# Altium schematic sheet DP Mux.SchDoc
size A4; SheetNumber: 2; SheetTotal: 2
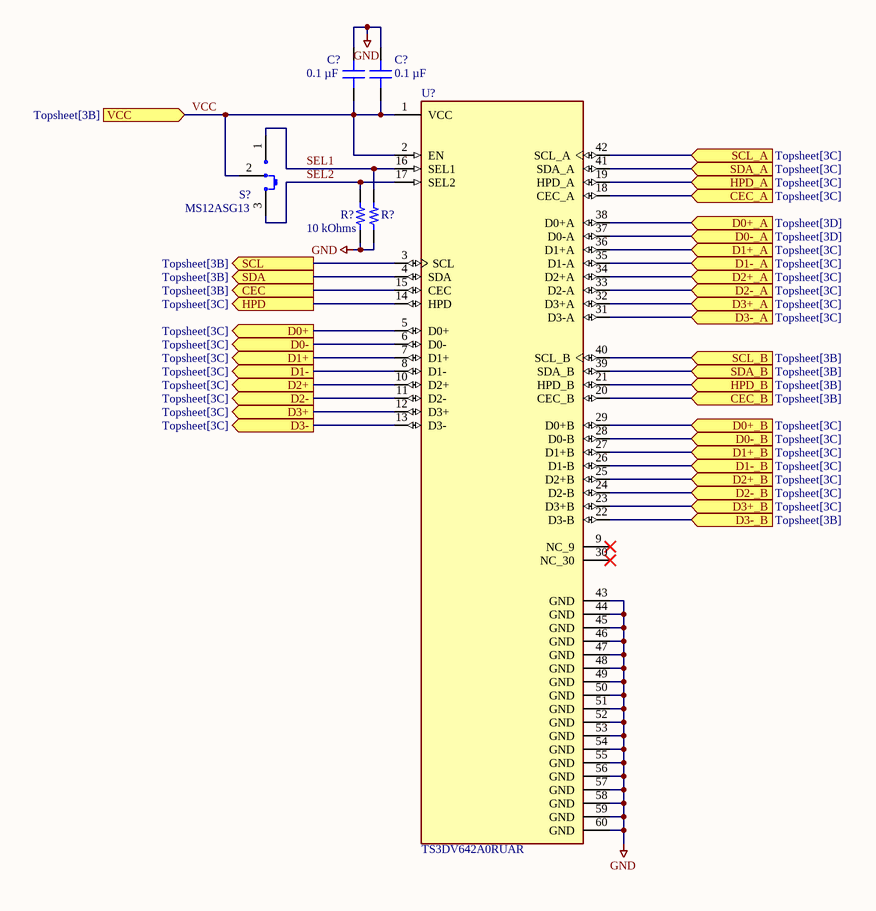
[diagram p0: DP Mux.SchDoc]

## Parts
(Parts that share a designator on the sheet are numbered #1, #2 ... from top to bottom, then left to right.)
C?#1  0.1 µF  [CAP 0402_1005]
C?#2  0.1 µF  [CAP 0402_1005]
R?#1  10 kOhms  [RES 0402_1005]
R?#2  10 kOhms  [RES 0402_1005]  (value not drawn)
S?  MS12ASG13  [NKK MS12ASG13]
U?  TS3DV642A0RUAR  [QFN50P900X350X80-43N]

## Ports
CEC (out, see Topsheet[3B]), CEC_A (in, see Topsheet[3C]), CEC_B (in, see Topsheet[3B]), D0+ (out, see Topsheet[3C]), D0+_A (in, see Topsheet[3D]), D0+_B (in, see Topsheet[3C]), D0- (out, see Topsheet[3C]), D0-_A (in, see Topsheet[3D]), D0-_B (in, see Topsheet[3C]), D1+ (out, see Topsheet[3C]), D1+_A (in, see Topsheet[3C]), D1+_B (in, see Topsheet[3C]), D1- (out, see Topsheet[3C]), D1-_A (in, see Topsheet[3C]), D1-_B (in, see Topsheet[3C]), D2+ (out, see Topsheet[3C]), D2+_A (in, see Topsheet[3C]), D2+_B (in, see Topsheet[3C]), D2- (out, see Topsheet[3C]), D2-_A (in, see Topsheet[3C]), D2-_B (in, see Topsheet[3C]), D3+ (out, see Topsheet[3C]), D3+_A (in, see Topsheet[3C]), D3+_B (in, see Topsheet[3C]), D3- (out, see Topsheet[3C]), D3-_A (in, see Topsheet[3C]), D3-_B (in, see Topsheet[3B]), HPD (out, see Topsheet[3C]), HPD_A (in, see Topsheet[3C]), HPD_B (in, see Topsheet[3B]), SCL (out, see Topsheet[3B]), SCL_A (in, see Topsheet[3C]), SCL_B (in, see Topsheet[3B]), SDA (out, see Topsheet[3B]), SDA_A (in, see Topsheet[3C]), SDA_B (in, see Topsheet[3B]), VCC (in, see Topsheet[3B])

## Nets
GND: C?#1.2 C?#2.2 R?#1.1 R?#2.1 U?.43(GND) U?.44(GND) U?.45(GND) U?.46(GND) U?.47(GND) U?.48(GND) U?.49(GND) U?.50(GND) U?.51(GND) U?.52(GND) U?.53(GND) U?.54(GND) U?.55(GND) U?.56(GND) U?.57(GND) U?.58(GND) U?.59(GND) U?.60(GND)
CEC: U?.15(CEC) ; port CEC
CEC_A: U?.18(CEC_A) ; port CEC_A
CEC_B: U?.20(CEC_B) ; port CEC_B
D0+: U?.5(D0+) ; port D0+
D0+_A: U?.38(D0+A) ; port D0+_A
D0+_B: U?.29(D0+B) ; port D0+_B
D0-: U?.6(D0-) ; port D0-
D0-_A: U?.37(D0-A) ; port D0-_A
D0-_B: U?.28(D0-B) ; port D0-_B
D1+: U?.7(D1+) ; port D1+
D1+_A: U?.36(D1+A) ; port D1+_A
D1+_B: U?.27(D1+B) ; port D1+_B
D1-: U?.8(D1-) ; port D1-
D1-_A: U?.35(D1-A) ; port D1-_A
D1-_B: U?.26(D1-B) ; port D1-_B
D2+: U?.10(D2+) ; port D2+
D2+_A: U?.34(D2+A) ; port D2+_A
D2+_B: U?.25(D2+B) ; port D2+_B
D2-: U?.11(D2-) ; port D2-
D2-_A: U?.33(D2-A) ; port D2-_A
D2-_B: U?.24(D2-B) ; port D2-_B
D3+: U?.12(D3+) ; port D3+
D3+_A: U?.32(D3+A) ; port D3+_A
D3+_B: U?.23(D3+B) ; port D3+_B
D3-: U?.13(D3-) ; port D3-
D3-_A: U?.31(D3-A) ; port D3-_A
D3-_B: U?.22(D3-B) ; port D3-_B
HPD: U?.14(HPD) ; port HPD
HPD_A: U?.19(HPD_A) ; port HPD_A
HPD_B: U?.21(HPD_B) ; port HPD_B
SCL: U?.3(SCL) ; port SCL
SCL_A: U?.42(SCL_A) ; port SCL_A
SCL_B: U?.40(SCL_B) ; port SCL_B
SDA: U?.4(SDA) ; port SDA
SDA_A: U?.41(SDA_A) ; port SDA_A
SDA_B: U?.39(SDA_B) ; port SDA_B
SEL1: R?#2.2 S?.1 U?.16(SEL1)
SEL2: R?#1.2 S?.3 U?.17(SEL2)
VCC: C?#1.1 C?#2.1 S?.2(COM) U?.1(VCC) U?.2(EN) ; port VCC

Not connected (* = marked no-connect by the designer): U? 9(NC_9)* 30(NC_30)*

## Library data of the parts
C?#1 C?#2 = C0402C104K4RECAUTO: CAP CER 0402 0.1UF 16V X7R 10%; manufacturer: KEMET; Part Number: C0402C104K4RECAUTO; Value: 0.1 µF; Applications: Automotive, ESD Protection; Capacitance: 0.1 µF; componentlink1description: Datasheet; componentlink1url: https://api.kemet.com/component-edge/download/datasheet/C0402C104K4RECAUTO.pdf; componentlink2description: DigiKey Link; componentlink2url: https://www.digikey.com/en/products/detail/kemet/C0402C104K4RECAUTO/8563695; Device Package: 0402 (1005 Metric); lastupdated: 2022-09-19 12:57:36 PM; Lifecycle Status: Active; Minimum Order: 1; Mounting Type: Surface Mount, MLCC; Operating Temperature: -55°C ~ 125°C; Package / Case: 0402 (1005 Metric); packaging: TapeAndReel; partid: 1731; Part Status: Active; price: 0.01; Ratings: AEC-Q200; series: ESD SMD Auto X7R; Size / Dimension: 0.039" L x 0.020" W (1.00mm x 0.50mm); Supplier 1: DigiKey; Supplier Part Number 1: 399-17167-1-ND; Temperature Coefficient: X7R; Thickness (Max): 0.022" (0.55mm); Tolerance: ±10%; Voltage - Rated: 16V
R?#1 R?#2 = RP73PF1E10KBTD: RES 10K OHM 0.1% 1/10W 0402; Manufacturer: TE Connectivity Passive Product; Power (Watts): 0.1W, 1/10W; Temperature Coefficient: ±25ppm/°C; Part Number: RP73PF1E10KBTD; Value: 10 kOhms; ComponentLink1Description: Datasheet; ComponentLink1URL: https://www.te.com/commerce/DocumentDelivery/DDEController?Action=srchrtrv&DocNm=1773272&DocType=DS&DocLang=English; ComponentLink2Description: DigiKey Link; ComponentLink2URL: https://www.digikey.com/en/products/detail/te-connectivity-passive-product/RP73PF1E10KBTD/8260957; Composition: Thin Film; Device Package: 0402 (1005 Metric); Height - Seated (Max): 0.014" (0.35mm); LastUpdated: 2022-09-19 1:15:04 PM; Lifecycle Status: Active; Minimum Order: 1; Number of Terminations: 2; Operating Temperature: -55°C ~ 155°C; Package / Case: 0402 (1005 Metric); Packaging: TapeAndReel; PartId: 2434; Part Status: Active; Price: 0.09; Resistance: 10 kOhms; Series: RP73, Holsworthy; Size / Dimension: 0.039" L x 0.020" W (1.00mm x 0.50mm); Supplier 1: DigiKey; Supplier Part Number 1: A127415CT-ND; Supplier Device Package: 0402; Tolerance: ±0.1%
S? = MS12ASG13: SWITCH SLIDE SPDT 0.4VA 28V; Manufacturer: NKK Switches; Actuator Length: 5.10mm; Actuator Type: Standard; Contact Timing: Non-Shorting (BBM); Current Rating (Amps): 0.4VA (AC/DC); Switch Function: On-On; Part Number: MS12ASG13; Circuit: SPDT; ComponentLink1Description: Datasheet; ComponentLink1URL: https://www.nkkswitches.com/pdf/MSnonilluminated.pdf; ComponentLink2Description: DigiKey Link; ComponentLink2URL: https://www.digikey.com/en/products/detail/nkk-switches/MS12ASG13/1052535; Contact Finish: Gold; Contact Material: Copper; Features: Epoxy Sealed Terminals; LastUpdated: 2022-09-26 3:18:31 AM; Lifecycle Status: Active; Minimum Order: 1; Mounting Type: Through Hole; Operating Temperature: -30°C ~ 85°C; Packaging: Bulk; PartId: 6; Part Status: Active; Price: 2.95; Series: MS; Supplier 1: DigiKey; Supplier Part Number 1: 360-2388-ND; Termination Style: PC Pin; Voltage Rating - AC: 28 V; Voltage Rating - DC: 28 V
U? = TS3DV642A0RUAR: Multi-Channel Differential Switch/Multiplexer Targeting DVI/HDMI & DisplayPort Applications 42-WQFN -40 to 85; MF: Texas Instruments; Texas_Instruments-Purchase-URL: https://snapeda.com/shop?store=Texas+Instruments&id=50654; SnapEDA_Link: https://www.snapeda.com/parts/TS3DV642A0RUAR/Texas%20Instruments/view-part/50654/?ref=snap; Price: None; Availability: Unavailable; Value: *; MP: TS3DV642A0RUAR; Package: WQFN-42 Texas Instruments